# Altium project BMS_Masterboard (Trapezoid).PrjPcb (part 2 of 2)

## Sheet PROCESSOR.SchDoc
size A
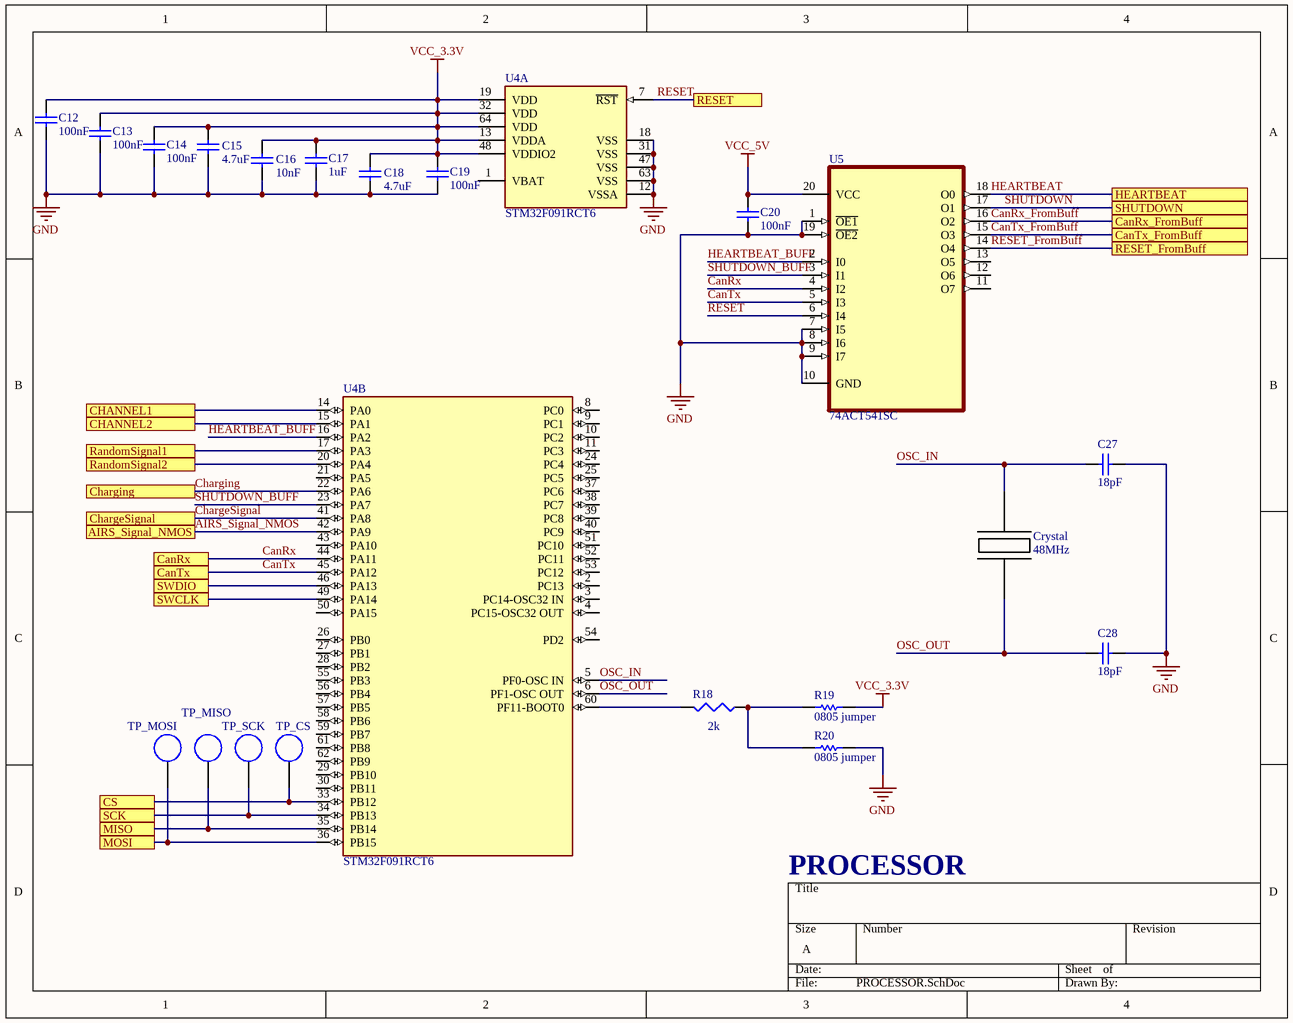
[diagram p2: PROCESSOR.SchDoc]

### Parts
C12  100nF  [Cap, 5mm TH, Ceramic]
C13  100nF  [Cap, 5mm TH, Ceramic]
C14  100nF  [Cap, 5mm TH, Ceramic]
C15  4.7uF  [Cap, 5mm TH, Ceramic]
C16  10nF  [Cap, 5mm TH, Ceramic]
C17  1uF  [Cap, 5mm TH, Ceramic]
C18  4.7uF  [Cap, 5mm TH, Ceramic]
C19  100nF  [Cap, 5mm TH, Ceramic]
C20  100nF  [Cap, 5mm TH, Ceramic]
C27  18pF  [Cap, 5mm TH, Ceramic]
C28  18pF  [Cap, 5mm TH, Ceramic]
Crystal  48MHz  [CrystalOscillator]
R18  2k  [1/4W TH Resistor]
R19  0805 jumper  [RESC2013X60X35LL20T20]
R20  0805 jumper  [RESC2013X60X35LL20T20]
TP_CS  5015  [5015]  (value not drawn)
TP_MISO  5015  [5015]  (value not drawn)
TP_MOSI  5015  [5015]  (value not drawn)
TP_SCK  5015  [5015]  (value not drawn)
U4  STM32F091RCT6  [FP-LQFP64-5W-MFG]  (parts A,B of 2)
U5  74ACT541SC  [SOIC127P1032X265-20N]

### Ports
AIRS_Signal_NMOS, CanRx, CanRx_FromBuff, CanTx, CanTx_FromBuff, CHANNEL1, CHANNEL2, ChargeSignal, Charging, CS, HEARTBEAT, MISO, MOSI, RandomSignal1, RandomSignal2, RESET, RESET_FromBuff, SCK, SHUTDOWN, SWCLK, SWDIO

### Nets
GND: C12.1(Pos) C13.1(Pos) C14.1(Pos) C15.1(Pos) C16.1(Pos) C17.1(Pos) C18.1(Pos) C19.1(Pos) C20.1(Pos) C27.1(Pos) C28.1(Pos) R20.1 U4.12(VSSA) U4.18(VSS) U4.31(VSS) U4.47(VSS) U4.63(VSS) U5.1(~{OE1}) U5.7(I5) U5.8(I6) U5.9(I7) U5.10(GND) U5.19(~{OE2})
VCC_3.3V: C12.2(Neg) C13.2(Neg) C14.2(Neg) C15.2(Neg) C16.2(Neg) C17.2(Neg) C18.2(Neg) C19.2(Neg) R19.2 U4.13(VDDA) U4.19(VDD) U4.32(VDD) U4.48(VDDIO2) U4.64(VDD)
VCC_5V: C20.2(Neg) U5.20(VCC)
AIRS_Signal_NMOS: U4.42(PA9) ; port AIRS_Signal_NMOS
CanRx: U4.44(PA11) U5.4(I2) ; port CanRx
CanRx_FromBuff: U5.16(O2) ; port CanRx_FromBuff
CanTx: U4.45(PA12) U5.5(I3) ; port CanTx
CanTx_FromBuff: U5.15(O3) ; port CanTx_FromBuff
CHANNEL1: U4.14(PA0) ; port CHANNEL1
CHANNEL2: U4.15(PA1) ; port CHANNEL2
ChargeSignal: U4.41(PA8) ; port ChargeSignal
Charging: U4.22(PA6) ; port Charging
HEARTBEAT: U5.18(O0) ; port HEARTBEAT
HEARTBEAT_BUFF: U4.16(PA2) U5.2(I0)
MISO: TP_MISO.1 U4.35(PB14) ; port MISO
OSC_IN: C27.2(Neg) Crystal.2 U4.5(PF0-OSC_IN)
OSC_OUT: C28.2(Neg) Crystal.1 U4.6(PF1-OSC_OUT)
RESET: U4.7(~{RST}) U5.6(I4) ; port RESET
RESET_FromBuff: U5.14(O4) ; port RESET_FromBuff
SHUTDOWN: U5.17(O1) ; port SHUTDOWN
SHUTDOWN_BUFF: U4.23(PA7) U5.3(I1)
SWCLK: U4.49(PA14) ; port SWCLK
SWDIO: U4.46(PA13) ; port SWDIO
NetR18_1: R18.1 R19.1 R20.2
NetR18_2: R18.2 U4.60(PF11-BOOT0)
NetTP_CS_1: TP_CS.1 U4.33(PB12) ; port CS
NetTP_MOSI_1: TP_MOSI.1 U4.36(PB15) ; port MOSI
NetTP_SCK_1: TP_SCK.1 U4.34(PB13) ; port SCK
NetU4_17: U4.17(PA3) ; port RandomSignal1
NetU4_20: U4.20(PA4) ; port RandomSignal2

Not connected (* = marked no-connect by the designer): U4 1(VBAT) 2(PC13) 3(PC14-OSC32_IN) 4(PC15-OSC32_OUT) 8(PC0) 9(PC1) 10(PC2) 11(PC3) 21(PA5) 24(PC4) 25(PC5) 26(PB0) 27(PB1) 28(PB2) 29(PB10) 30(PB11) 37(PC6) 38(PC7) 39(PC8) 40(PC9) 43(PA10) 50(PA15) 51(PC10) 52(PC11) 53(PC12) 54(PD2) 55(PB3) 56(PB4) 57(PB5) 58(PB6) 59(PB7) 61(PB8) 62(PB9); U5 11(O7) 12(O6) 13(O5)

### Notes on the sheet
- PROCESSOR

### Library data of the parts
C12-C20 C27 C28 = Cap, 5MM TH, Ceramic: Generic Cap, 5MM TH, Ceramic; TargetLibrary: RITRacing-Passives; Value: Value?; Publisher: T.Tallo; Published: 22Oct2016; Status: Active
Crystal = CrystalOscillator
R18 = Resistor, TH: Generic TH Resistor; TargetLibrary: RITRacing-Passives; Value: Value?; Publisher: T.Tallo; Published: 22Oct2016; Status: Active
R19 R20 = CMP-2000-06973-1: Chip Resistor, 0 Ohm, +/- 5%, 0.125 W, -55 to 155 degC, 0805 (2012 Metric) , RoHS, Tape and Reel; Manufacturer: Samsung Electro-Mechanics; Resistance: 0O; Temp Coefficient: ±200ppm/°C; Rated Power: 0.125W; Mounting Technology: SurfaceMount; Tolerance (%): ±5%; Package Reference: 0805; Size Code: 0805; Package Description: 2-Pin Chip Resistor, Body 2 x 1.25 mm; Manufacturer URL: http://www.samsungsem.com/global/index.jsp; Datasheet URL: https://datasheet.ciiva.com/15196/getdatasheetpartid-499011-15196236.pdf; Datasheet Version: 11/2010
TP_CS TP_MISO TP_MOSI TP_SCK = 5015: SMD Test Point; Manufacturer: Keystone Electronics; TargetLibrary: RITRacing-Connectors; PartNumber: 5015; Publisher: T.Tallo; Published: 22Oct2016; Status: Active; ComponentLink1URL: http://www.mouser.com/ds/2/215/005-5009-743680.pdf; ComponentLink1Description: Datasheet
U4 = CMP-12105-000069-1: IC MCU 32BIT 256KB FLASH 64LQFP; Manufacturer: STMicroelectronics; Ram Size: 32KBytes; Number Of A/D Converters: 1; Standoff Height: 0.05mm; Number Of I/Os: 52; Number Of Pwm Channels: 6; Max Supply Voltage: 3.6V; Data Bus Width: 32bits; Max Junction Temp: +105°C; Number Of Spi Channels: 2; Min Supply Voltage: 2V; Number Of Adc Channels: 19; Memory Size: 256KBytes; Frequency: 48MHz; Nominal Supply Current: 0.9-26.9mA; Number Of Uart Channels: 8; Core Architecture: ARM Cortex-M0; Number Of Timers/Counters: 10; Interface: I2C,SPI,USART,CAN,LIN,IrDA,I2S,SMBus; Category: IC; Digikey Description: IC MCU 32BIT 256KB FLASH 64LQFP; Temperature Range Low: -40°C; Lead Free: Yes; ComponentLink2Description: Datasheet; Octopart: https://octopart.com/stm32f091rct6-stmicroelectronics-51988683; Device Class L1: Integrated Circuits (ICs); Automotive: No; Temperature Range High: +85°C; Ambient Temperature Range Low: -40°C; Device Class L2: Embedded Processors and Controllers; Number Of I2C Channels: 2; Memory Type: FLASH; Device Class L3: Microcontrollers; Height: 1.6mm; Temperature: -40°C to +85°C; Ambient Temperature Range High: +85°C; RoHS: TRUE; Ipc Land Pattern Name: QFP50P1200X1200X160-64; ComponentLink2URL: https://www.st.com/resource/en/datasheet/stm32f091rc.pdf; Manufacturer Part Number: STM32F091RCT6; Package: LQFP64-5W; Mouser Description: ARM Microcontrollers - MCU 16/32-BITS MICROS; Number Of Cores: 1
U5 = 74ACT541SC: Buffer, Non-Inverting 1 Element 8 Bit per Element 3-State Output 20-SOIC; MF: ON Semiconductor; DigiKey-Purchase-URL: https://snapeda.com/shop?store=DigiKey&id=431052; Mouser-Purchase-URL: https://snapeda.com/shop?store=Mouser&id=431052; SnapEDA_Link: https://www.snapeda.com/parts/74ACT541SC/ON%20Semiconductor/view-part/431052/?ref=snap; Price: None; Arrow_Electronics-Purchase-URL: https://snapeda.com/shop?store=Arrow+Electronics&id=431052; MP: 74ACT541SC; Value: *; Availability: Warning; Package: SOIC-20 Fairchild Semiconductor

## Sheet COMMUNICATIONS.SchDoc
size A
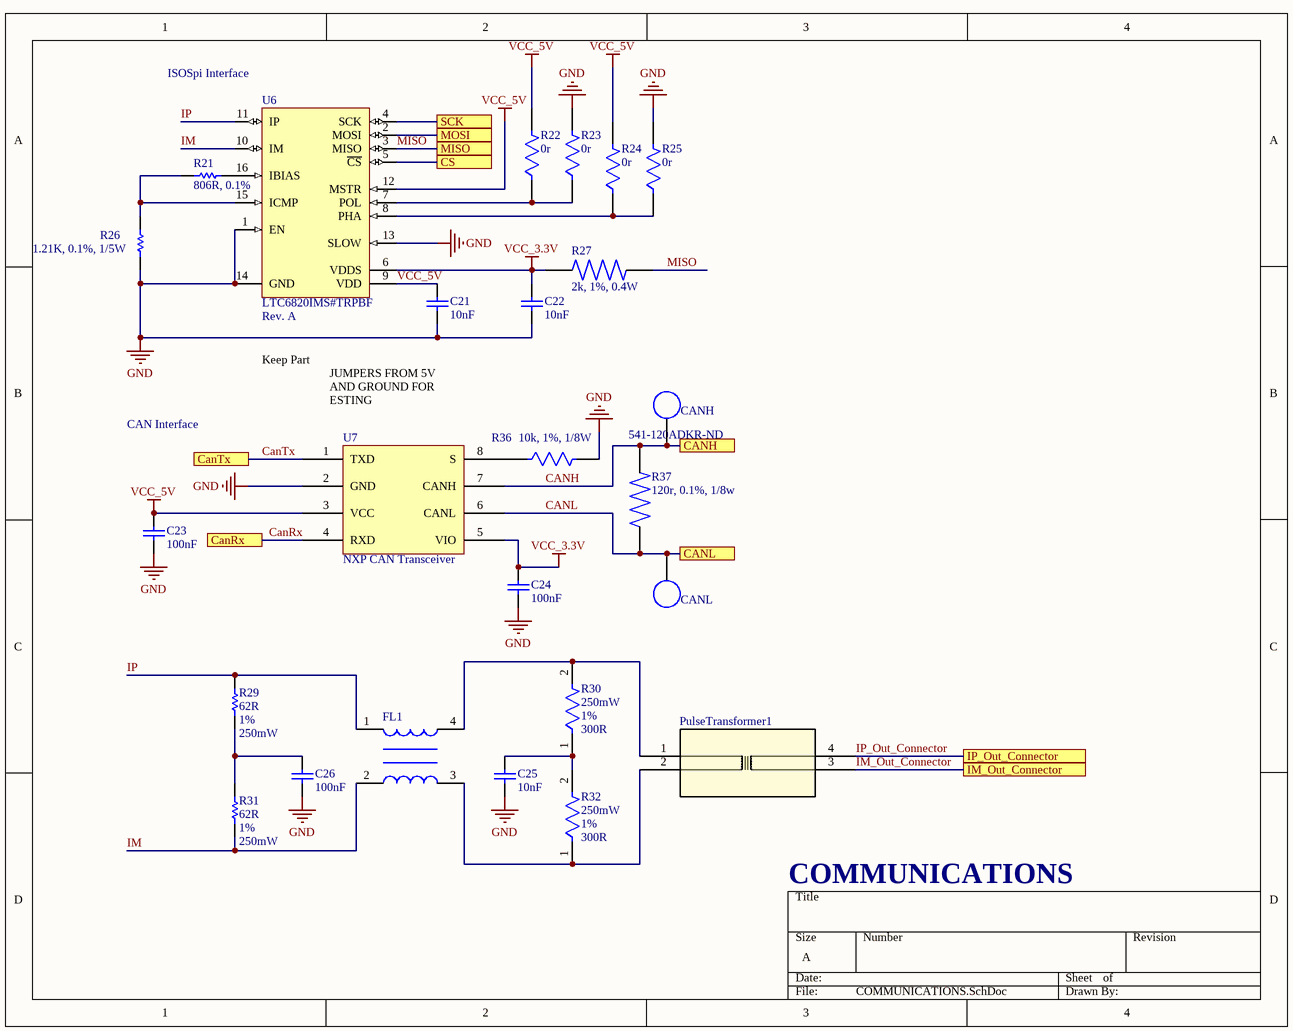
[diagram p3: COMMUNICATIONS.SchDoc]

### Parts
C21  10nF  [CAPC2013X70X45LL15T25]
C22  10nF  [CAPC2013X70X45LL15T25]
C23  100nF  [CAPC2013X145X45NL30T25]
C24  100nF  [CAPC2013X145X45NL30T25]
C25  10nF  [CAPC2013X70X45LL15T25]
C26  100nF  [CAPC2013X145X45NL30T25]
CANH  5015  [5015]  (value not drawn)
CANL  5015  [5015]  (value not drawn)
FL1  ACT45B-220-2P-TL003  [FIL_ACT45B-220-2P-TL003]  (value not drawn)
PulseTransformer1  PE-68386NLT  [PE-68386NL_PUL]  (value not drawn)
R21  806R, 0.1%  [RESC2013X50X30NL20T20]
R22  0r  [FP-CRCW0805-HPe3-IPC_A]
R23  0r  [FP-CRCW0805-HPe3-IPC_A]
R24  0r  [FP-CRCW0805-HPe3-IPC_A]
R25  0r  [FP-CRCW0805-HPe3-IPC_A]
R26  1.21K, 0.1%, 1/5W  [RESC2013X50X30NL20T20]
R27  2k, 1%, 0.4W  [RESC2012X50N]
R29  Resistance: 62R  Tolerance: 1%  Max Power Dissipation: 250mW  [RESC3216X70X50NL05T20]  (hidden comment: ERJ-8ENF62R0V)
R30  Power Rating: 250mW  Tolerance: 1%  Resistance: 300R  [FP-CRCW1206-e3-IPC_A]  (hidden comment: CRCW1206300RFKEA)
R31  Resistance: 62R  Tolerance: 1%  Max Power Dissipation: 250mW  [RESC3216X70X50NL05T20]  (hidden comment: ERJ-8ENF62R0V)
R32  Power Rating: 250mW  Tolerance: 1%  Resistance: 300R  [FP-CRCW1206-e3-IPC_A]  (hidden comment: CRCW1206300RFKEA)
R36  10k, 1%, 1/8W  [FP-CRCW0805-e3-IPC_A]
R37  120r, 0.1%, 1/8w  Supplier Part Number 1: 541-120ADKR-ND  [RESC2012X55N]
U6  LTC6820IMS#TRPBF  DatasheetVersion: Rev. A  [TSSOP50P490X110-16N]
U7  NXP CAN Transceiver  [NXP CAN Tranceiver]

### Ports
CANH, CANL, CanRx, CanTx, CS, IM_Out_Connector, IP_Out_Connector, MISO, MOSI, SCK

### Nets
GND: C21.1 C22.1 C23.1 C24.1 C25.1 C26.1 R23.2 R25.2 R26.1 R36.2 U6.1(EN) U6.13(SLOW) U6.14(GND) U7.2(GND)
VCC_3.3V: C22.2 C24.2 R27.2 U6.6(VDDS) U7.5(VIO)
VCC_5V: C21.2 C23.2 R22.2 R24.2 U6.9(VDD) U6.12(MSTR) U7.3(VCC)
CANH: CANH.1 R37.2 U7.7(CANH) ; port CANH
CANL: CANL.1 R37.1 U7.6(CANL) ; port CANL
CanRx: U7.4(RXD) ; port CanRx
CanTx: U7.1(TXD) ; port CanTx
IM: FL1.2 R31.1 U6.10(IM)
IM_Out_Connector: PulseTransformer1.3 ; port IM_Out_Connector
IP: FL1.1 R29.2 U6.11(IP)
IP_Out_Connector: PulseTransformer1.4 ; port IP_Out_Connector
MISO: R27.1 U6.3(MISO) ; port MISO
NetC25_2: C25.2 R30.1 R32.2
NetC26_2: C26.2 R29.1 R31.2
NetFL1_3: FL1.3 PulseTransformer1.2 R32.1
NetFL1_4: FL1.4 PulseTransformer1.1 R30.2
NetR21_1: R21.1 R26.2 U6.15(ICMP)
NetR21_2: R21.2 U6.16(IBIAS)
NetR22_1: R22.1 R23.1 U6.7(POL)
NetR24_1: R24.1 R25.1 U6.8(PHA)
NetR36_1: R36.1 U7.8(S)
NetTP_CS_1: U6.5(~{CS}) ; port CS
NetTP_MOSI_1: U6.2(MOSI) ; port MOSI
NetTP_SCK_1: U6.4(SCK) ; port SCK

### Notes on the sheet
- (near U6) ISOSpi Interface
- Keep Part
- CAN Interface
- JUMPERS FROM 5V AND GROUND FOR ESTING
- COMMUNICATIONS

### Library data of the parts
C21 C22 C25 = CMP-2007-00806-1: Manufacturer: Murata; Part Number: GCM216R72A103KA37D; Tolerance: 10%; Voltage Rating: 100V; Dielectric: X7R; Supplier 1: Digi-Key; Supplier Part Number 1: 490-6060-1-ND; Manufacturer 1: Murata; Manufacturer Part Number 1: GCM216R72A103KA37D; RoHS: Yes; Category: Ceramic Capacitors; Stock 1: 2316; Pricing 1: 1=0.36000, 10=0.24900, 50=0.16640, 100=0.14140, 500=0.09980, 1000=0.08732 (USD); Mount: Surface Mount; Case/Package: 0805; Case Code (Metric): 2012; Case Code (Imperial): 0805; Min Operating Temperature: -55°C; Max Operating Temperature: 125°C; Capacitance: 10nF; Packaging: Tape and Reel; Package Quantity: 1; Termination: SMD/SMT; Voltage Rating (DC): 100V; Voltage: 100V; Series: GCM; Construction: Flat; Length: 2mm; Width: 0.049inch; Height: 0.6mm; Thickness: 0.028inch; Depth: 1.25mm; Ratings: AEC-Q200; Radiation Hardening: No; Lead Free: Lead Free; RoHS Compliant: Yes; ComponentLink1URL: https://datasheet.ciiva.com/11620/product-11620072.pdf?src-supplier=Avnet; ComponentLink1Description: https://datasheet.ciiva.com/11620/product-11620072.pdf?src-supplier=Avnet; ComponentLink2URL: https://datasheet.ciiva.com/18183/getdatasheetpartid-223896-18183680.pdf?src-supplier=Verical; ComponentLink2Description: https://datasheet.ciiva.com/18183/getdatasheetpartid-223896-18183680.pdf?src-supplier=Verical; ComponentLink3URL: https://datasheet.ciiva.com/6270/s0717e-6270558.pdf?src-supplier=Digi-Key; ComponentLink3Description: https://datasheet.ciiva.com/6270/s0717e-6270558.pdf?src-supplier=Digi-Key; ComponentLink4URL: https://datasheet.ciiva.com/16214/s0717e-16214647.pdf?src-supplier=Future+Electronics; ComponentLink4Description: https://datasheet.ciiva.com/16214/s0717e-16214647.pdf?src-supplier=Future+Electronics
C23 C24 C26 = CMP-2007-03212-1: Manufacturer: Murata; Part Number: GCJ21BR71H104KA01L; Tolerance: 10%; Voltage Rating: 50V; Dielectric: X7R; Supplier 1: Digi-Key; Supplier Part Number 1: 490-5803-1-ND; Manufacturer 1: Murata; Manufacturer Part Number 1: GCJ21BR71H104KA01L; RoHS: Yes; Category: Ceramic Capacitors; Stock 1: 105376; Pricing 1: 1=0.48000, 10=0.34200, 50=0.25880, 100=0.22540, 500=0.16698, 1000=0.14193 (USD); Mount: Surface Mount; Case/Package: 0805; Case Code (Imperial): 0805; Case Code (Metric): 2012; Min Operating Temperature: -55°C; Max Operating Temperature: 125°C; Capacitance: 100nF; Packaging: Tape and Reel; Package Quantity: 3000; Termination: SMD/SMT; Voltage Rating (DC): 50V; Series: GCJ; Construction: Flat; Features: Soft Termination; Length: 2mm; Width: 0.049inch; Height: 1.25mm; Thickness: 0.057inch; Depth: 1.25mm; Ratings: AEC-Q200; Radiation Hardening: No; RoHS Compliant: Yes; Lead Free: Lead Free; ComponentLink1URL: https://datasheet.ciiva.com/17453/product-17453782.pdf?src-supplier=Avnet+Europe; ComponentLink1Description: https://datasheet.ciiva.com/17453/product-17453782.pdf?src-supplier=Avnet+Europe; ComponentLink2URL: https://datasheet.ciiva.com/18183/getdatasheetpartid-663717-18183469.pdf?src-supplier=Verical; ComponentLink2Description: https://datasheet.ciiva.com/18183/getdatasheetpartid-663717-18183469.pdf?src-supplier=Verical; ComponentLink3URL: https://datasheet.ciiva.com/136/s0717e-136749.pdf?src-supplier=Digi-Key; ComponentLink3Description: https://datasheet.ciiva.com/136/s0717e-136749.pdf?src-supplier=Digi-Key; ComponentLink4URL: https://datasheet.ciiva.com/136/s0717e-136750.pdf?src-supplier=Digi-Key; ComponentLink4Description: https://datasheet.ciiva.com/136/s0717e-136750.pdf?src-supplier=Digi-Key; ComponentLink5URL: https://datasheet.ciiva.com/136/s0717e-136751.pdf?src-supplier=Digi-Key; ComponentLink5Description: https://datasheet.ciiva.com/136/s0717e-136751.pdf?src-supplier=Digi-Key
CANH CANL = 5015: as TP_CS on sheet PROCESSOR; PartNumber: 5015; Publisher: T.Tallo; Published: 22Oct2016; Status: Active; ComponentLink1URL: http://www.mouser.com/ds/2/215/005-5009-743680.pdf; ComponentLink1Description: Datasheet
FL1 = ACT45B-220-2P-TL003: 100ÂµH @ 100kHz 2 Line Common Mode Choke Surface Mount 5.8 kOhms @ 10MHz 150mA DCR 2Ohm; Package: None; Price: None; Value: *; MP: ACT45B-220-2P-TL003; Availability: Unavailable; Supplier 1: Digi-Key; Supplier Part Number 1: 445-3957-1-ND; Supplier 2: Digi-Key; Supplier Part Number 2: 445-3957-6-ND; Supplier 3: Digi-Key; Supplier Part Number 3: 445-3957-2-ND; Supplier 4: Mouser; Supplier Part Number 4: 810-ACT45B2202PTL003
PulseTransformer1 = PE-68386NLT: No Description Available; Vendor: Pulse Electronics Corporation; Built_By: EMA_Cory; SourceLibrary: Pulse_Electronics_2019-12-18; Manufacturer_Part_Number: PE-68386NLT; Copyright: Copyright (C) 2018 Accelerated Designs. All rights reserved; RefDes: RefDes; Type: DEV; Supplier 1: Digi-Key; Supplier Part Number 1: 553-1776-1-ND; Supplier 2: Digi-Key; Supplier Part Number 2: 553-1776-6-ND; Supplier 3: Digi-Key; Supplier Part Number 3: 553-1776-2-ND; Supplier 4: Mouser; Supplier Part Number 4: 673-PE-68386NLT
R21 = CMP-2001-04126-1: Part Number: CRCW0805806RFKEA; Manufacturer: Vishay Dale; Manufacturer Part Number 1: TNPW0805806RBEEN; Power Rating: 125mW; Voltage Rating: 150V; Temperature Coefficient: 25ppm/°C; Voltage Rating (DC): 100V; Supplier 1: Digi-Key; Supplier Part Number 1: 541-TNPW0805806RBEENTR-ND; Manufacturer 1: Vishay Dale; RoHS: Yes; Category: Chip SMD Resistors; Pricing 1: 1000=0.31280 (USD); Case/Package: 0805; Case Code (Metric): 2012; Case Code (Imperial): 0805; Contact Plating: Tin; Min Operating Temperature: -55°C; Max Operating Temperature: 125°C; Package Quantity: 1000; Packaging: Tape and Reel; Resistance: 806R; Tolerance: 0.1%; Resistor Type: Thin Film; Number of Terminations: 2; Termination: SMD/SMT; Max Power Dissipation: 125mW; Features: Moisture Resistant,Automotive AEC-Q200,Anti-Sulfur; Series: TNPW; Length: 0.079inch; Width: 0.049inch; Height: 0.022inch; Radiation Hardening: No; RoHS Compliant: Yes; ComponentLink1URL: https://datasheet.ciiva.com/2612/tnpw-e3-2612881.pdf?src-supplier=Digi-Key; ComponentLink1Description: https://datasheet.ciiva.com/2612/tnpw-e3-2612881.pdf?src-supplier=Digi-Key; ComponentLink2URL: https://datasheet.ciiva.com/8919/tnpw-e3-8919757.pdf?src-supplier=Avnet; ComponentLink2Description: https://datasheet.ciiva.com/8919/tnpw-e3-8919757.pdf?src-supplier=Avnet; ComponentLink3URL: https://datasheet.ciiva.com/48524/tnpw-e3-48524410.pdf?src-supplier=Avnet; ComponentLink3Description: https://datasheet.ciiva.com/48524/tnpw-e3-48524410.pdf?src-supplier=Avnet; Supplier 2: Mouser; Supplier Part Number 2: 71-TNPW0805806RBEEN; Manufacturer 2: Vishay Dale; Manufacturer Part Number 2: TNPW0805806RBEEN; Stock 2: 696; Pricing 2: 1=0.92000, 10=0.82300, 50=0.82300, 100=0.62200, 500=0.52900, 1000=0.29900, 10000=0.26400 (USD)
R22-R25 = CMP-2001-04185-2: RES Thick Film, 0Ω, 0.5W, 0805; Manufacturer 1: Vishay Dale; Manufacturer Part Number 1: CRCW08050000Z0EAHP; Resistance: 0mR; Max Power Dissipation: 500mW; Power Rating: 330mW; Voltage Rating (DC): 150V; Temperature Coefficient: 0ppm/°C; Tolerance: 5%; Min Operating Temperature: -55°C; Features: Automotive AEC-Q200; Weight: 0.000194oz; Case Code (Metric): 2012; Package Quantity: 5000; Packaging: Tape and Reel; Height: 0.024inch; Composition: Thick Film; Case Code (Imperial): 0805; Military Standard: Not; Number of Pins: 2; Termination: Solder; Lead Free: Lead Free; Max Operating Temperature: 155°C; Radiation Hardening: No; Voltage Rating: 150V; Width: 0.049inch; Number of Terminations: 2; Contact Plating: Tin; Length: 2mm; Depth: 1.25mm; Case/Package: 0805; REACH SVHC: No SVHC; Mount: Surface Mount; Supplier 1: Digi-Key; Supplier Part Number 1: 541-0.0TBCT-ND; RoHS: Yes; Category: Chip SMD Resistors; Stock 1: 60898; Pricing 1: 1=0.21000, 10=0.17600, 25=0.12800, 50=0.09280, 100=0.06880, 250=0.05280, 500=0.04160, 1000=0.02880 (USD); Size Code: 0805; Resistor Type: Thick Film; Series: CRCW-HP; Construction: Rectangular; Technology: THICK FILM; RoHS Compliant: Yes; ComponentLink1URL: https://datasheet.ciiva.com/2474/crcwhpe3-2474632.pdf?src-supplier=Digi-Key; ComponentLink1Description: https://datasheet.ciiva.com/2474/crcwhpe3-2474632.pdf?src-supplier=Digi-Key; ComponentLink2URL: https://datasheet.ciiva.com/2474/crcwhpe3-2474633.pdf?src-supplier=Digi-Key; ComponentLink2Description: https://datasheet.ciiva.com/2474/crcwhpe3-2474633.pdf?src-supplier=Digi-Key; ComponentLink3URL: https://datasheet.ciiva.com/2474/crcwhpe3-2474634.pdf?src-supplier=Digi-Key; ComponentLink3Description: https://datasheet.ciiva.com/2474/crcwhpe3-2474634.pdf?src-supplier=Digi-Key; ComponentLink4URL: https://datasheet.ciiva.com/9109/crcwhpe3-9109934.pdf?src-supplier=Avnet; ComponentLink4Description: https://datasheet.ciiva.com/9109/crcwhpe3-9109934.pdf?src-supplier=Avnet; ComponentLink5URL: https://datasheet.ciiva.com/5549/crcwhpe3-46056-5549241.pdf?src-supplier=Mouser; ComponentLink5Description: https://datasheet.ciiva.com/5549/crcwhpe3-46056-5549241.pdf?src-supplier=Mouser; ComponentLink6URL: https://datasheet.ciiva.com/16883/crcwhpe3-16883643.pdf?src-supplier=Avnet+Europe; ComponentLink6Description: https://datasheet.ciiva.com/16883/crcwhpe3-16883643.pdf?src-supplier=Avnet+Europe; ComponentLink7URL: https://datasheet.ciiva.com/16498/crcwhpe3-16498294.pdf?src-supplier=Future+Electronics; ComponentLink7Description: https://datasheet.ciiva.com/16498/crcwhpe3-16498294.pdf?src-supplier=Future+Electronics; ComponentLink8URL: https://datasheet.ciiva.com/28621/1750852-28621406.pdf?src-supplier=Element14; ComponentLink8Description: https://datasheet.ciiva.com/28621/1750852-28621406.pdf?src-supplier=Element14; ComponentLink9URL: https://datasheet.ciiva.com/7859/crcwhpe3-7859727.pdf?src-supplier=Element14; ComponentLink9Description: https://datasheet.ciiva.com/7859/crcwhpe3-7859727.pdf?src-supplier=Element14
R26 = CMP-2001-04126-1: Part Number: CRCW0805806RFKEA; Manufacturer: Vishay Dale; Manufacturer Part Number 1: TNPW0805806RBEEN; Resistance: 806R; Power Rating: 125mW; Voltage Rating: 150V; Temperature Coefficient: 25ppm/°C; Voltage Rating (DC): 100V; Supplier 1: Digi-Key; Supplier Part Number 1: 541-TNPW0805806RBEENTR-ND; Manufacturer 1: Vishay Dale; RoHS: Yes; Category: Chip SMD Resistors; Pricing 1: 1000=0.31280 (USD); Case/Package: 0805; Case Code (Metric): 2012; Case Code (Imperial): 0805; Contact Plating: Tin; Min Operating Temperature: -55°C; Max Operating Temperature: 125°C; Package Quantity: 1000; Packaging: Tape and Reel; Tolerance: 0.1%; Resistor Type: Thin Film; Number of Terminations: 2; Termination: SMD/SMT; Max Power Dissipation: 125mW; Features: Moisture Resistant,Automotive AEC-Q200,Anti-Sulfur; Series: TNPW; Length: 0.079inch; Width: 0.049inch; Height: 0.022inch; Radiation Hardening: No; RoHS Compliant: Yes; ComponentLink1URL: https://datasheet.ciiva.com/2612/tnpw-e3-2612881.pdf?src-supplier=Digi-Key; ComponentLink1Description: https://datasheet.ciiva.com/2612/tnpw-e3-2612881.pdf?src-supplier=Digi-Key; ComponentLink2URL: https://datasheet.ciiva.com/8919/tnpw-e3-8919757.pdf?src-supplier=Avnet; ComponentLink2Description: https://datasheet.ciiva.com/8919/tnpw-e3-8919757.pdf?src-supplier=Avnet; ComponentLink3URL: https://datasheet.ciiva.com/48524/tnpw-e3-48524410.pdf?src-supplier=Avnet; ComponentLink3Description: https://datasheet.ciiva.com/48524/tnpw-e3-48524410.pdf?src-supplier=Avnet; Supplier 2: Mouser; Supplier Part Number 2: 71-TNPW0805806RBEEN; Manufacturer 2: Vishay Dale; Manufacturer Part Number 2: TNPW0805806RBEEN; Stock 2: 696; Pricing 2: 1=0.92000, 10=0.82300, 50=0.82300, 100=0.62200, 500=0.52900, 1000=0.29900, 10000=0.26400 (USD); Supplier 3: Digi-Key; Supplier Part Number 3: 541-2057-1-ND; Manufacturer 3: Vishay Dale; Manufacturer Part Number 3: TNPW08051K21BEEA; Stock 3: 4750; Pricing 3: 1=0.74000, 10=0.54800, 100=0.31930, 1000=0.17905, 2500=0.17544 (USD); Resistance Tolerance: 0.1%; REACH SVHC: Unknown; ComponentLink4URL: https://datasheet.ciiva.com/9105/tnpw-e3-9105739.pdf?src-supplier=Avnet; ComponentLink4Description: https://datasheet.ciiva.com/9105/tnpw-e3-9105739.pdf?src-supplier=Avnet; ComponentLink5URL: https://datasheet.ciiva.com/2608/tnpw-e3-2608321.pdf?src-supplier=Digi-Key; ComponentLink5Description: https://datasheet.ciiva.com/2608/tnpw-e3-2608321.pdf?src-supplier=Digi-Key; ComponentLink6URL: https://datasheet.ciiva.com/41828/tnpw-e3-41828137.pdf?src-supplier=Digi-Key; ComponentLink6Description: https://datasheet.ciiva.com/41828/tnpw-e3-41828137.pdf?src-supplier=Digi-Key
R27 = RCS08052K00FKEA: Res Thick Film 0805 2K Ohm 1% 0.4W ±100ppm/C Pad SMD Automotive T/R; Manufacturer 1: Vishay Dale; Resistance: 2kR; Max Power Dissipation: 400mW; Temperature Coefficient: 100ppm/°C; Package: None; Price: None; Value: *; MP: RCS08052K00FKEA; Availability: Unavailable; Supplier 1: Digi-Key; Supplier Part Number 1: 541-2840-1-ND; Manufacturer Part Number 1: RCS08052K00FKEA; RoHS: Yes; Category: Chip SMD Resistors; Stock 1: 4243; Pricing 1: 1=0.26000, 10=0.21800, 100=0.08510, 1000=0.03560, 2500=0.03264 (USD); Case/Package: 0805; Case Code (Metric): 2012; Case Code (Imperial): 0805; Min Operating Temperature: -55°C; Max Operating Temperature: 155°C; Packaging: Tape and Reel; Resistor Type: Thick Film; Number of Terminations: 2; Tolerance: 1%; Features: Automotive AEC-Q200; Length: 0.079inch; Width: 0.049inch; Height: 0.02inch; ComponentLink1URL: http://www.vishay.com/docs/20065/rcse3.pdf?src-supplier=Digi-Key; ComponentLink1Description: http://www.vishay.com/docs/20065/rcse3.pdf?src-supplier=Digi-Key
R29 R31 = CMP-2003-00451-1: Manufacturer: Panasonic; Temperature Coefficient: 100ppm/°C; Voltage Rating: 200V; Part Number: ERJ-8ENF62R0V; Supplier 1: Digi-Key; Supplier Part Number 1: P62.0FCT-ND; Manufacturer 1: Panasonic; Manufacturer Part Number 1: ERJ-8ENF62R0V; RoHS: Yes; Category: Chip SMD Resistors; Stock 1: 91284; Pricing 1: 1=0.10000, 10=0.09300, 100=0.03560, 1000=0.01569, 2500=0.01355 (USD); Mount: Surface Mount; Case/Package: 1206; Contact Plating: Tin; Case Code (Imperial): 1206; Case Code (Metric): 3216; Min Operating Temperature: -55°C; Max Operating Temperature: 155°C; Resistor Type: Thick Film; Packaging: Tape and Reel; Power Rating: 250mW; Package Quantity: 1; Termination: SMD/SMT; Number of Terminations: 2; Voltage Rating (DC): 200V; Features: Automotive AEC-Q200; Series: ERJ; Resistance Tolerance: 1%; Construction: Rectangular; Length: 3.2mm; Width: 1.6mm; Height: 0.028inch; Depth: 1.6mm; Radiation Hardening: No; REACH SVHC: Yes; Military Standard: Not; Lead Free: Lead Free; RoHS Compliant: Yes; ComponentLink1URL: https://datasheet.ciiva.com/9188/aoa0000ce2-9188406.pdf?src-supplier=Avnet; ComponentLink1Description: https://datasheet.ciiva.com/9188/aoa0000ce2-9188406.pdf?src-supplier=Avnet; ComponentLink2URL: https://datasheet.ciiva.com/22762/1678782-22762886.pdf?src-supplier=Farnell; ComponentLink2Description: https://datasheet.ciiva.com/22762/1678782-22762886.pdf?src-supplier=Farnell; ComponentLink3URL: https://datasheet.ciiva.com/46440/1678782-46440394.pdf?src-supplier=Element14; ComponentLink3Description: https://datasheet.ciiva.com/46440/1678782-46440394.pdf?src-supplier=Element14; Supplier 2: Digi-Key; Supplier Part Number 2: P62.0FDKR-ND; Manufacturer 2: Panasonic; Manufacturer Part Number 2: ERJ-8ENF62R0V; Stock 2: 91284; Pricing 2: 1=0.10000, 10=0.09300, 100=0.03560, 1000=0.01569, 2500=0.01355 (USD); Supplier 3: Newark; Supplier Part Number 3: 90W3970; Manufacturer 3: Panasonic; Manufacturer Part Number 3: ERJ-8ENF62R0V; Stock 3: 46632; Pricing 3: 1=0.00800, 25=0.00800, 50=0.00800, 100=0.00800, 250=0.00800, 500=0.00800, 1000=0.00800 (USD); Supplier 4: Mouser; Supplier Part Number 4: 667-ERJ-8ENF62R0V; Manufacturer 4: Panasonic; Manufacturer Part Number 4: ERJ-8ENF62R0V; Stock 4: 31443; Pricing 4: 1=0.10000, 10=0.09300, 50=0.09300, 100=0.03800, 250=0.03700, 500=0.03600, 1000=0.01600, 2500=0.01400, 5000=0.01300, 10000=0.01300 (USD)
R30 R32 = CMP-1014-00449-3: RES Thick Film, 300Ω, 1%, 0.25W, 100ppm/°C, 1206; Voltage Rating (DC): 200V; Number of Terminations: 2; Weight: 0.000353oz; Max Operating Temperature: 155°C; Features: Automotive AEC-Q200; Min Operating Temperature: -55°C; Case Code (Imperial): 1206; Voltage Rating: 200V; Termination: SMD/SMT; Military Standard: Not; Composition: Thick Film; Mount: Surface Mount; Package Quantity: 10; Length: 3.2mm; Depth: 1.6mm; Temperature Coefficient: 100ppm/°C; Width: 0.063inch; Contact Plating: Tin; Lead Free: Lead Free; Case Code (Metric): 3216; Radiation Hardening: No; Max Power Dissipation: 250mW; Working Voltage: 200V; Packaging: Tape and Reel; Height: 0.55mm; Case/Package: 1206; Supplier 1: Newark; Supplier Part Number 1: 27W4914
R36 = CMP-2001-04908-2: RES Thick Film, 10kΩ, 1%, 0.125W, 100ppm/°C, 0805; Manufacturer 1: Vishay; Manufacturer Part Number 1: CRCW080510K0FKEA; Resistance: 10kR; Voltage Rating (DC): 150V; Power Rating: 125mW; Weight: 0.000194oz; Package Quantity: 5000; Military Standard: Not; Max Operating Temperature: 155°C; Temperature Coefficient: 100ppm/°C; Contact Plating: Tin; Width: 1.25mm; Height: 0.45mm; Radiation Hardening: No; Tolerance: 1%; Min Operating Temperature: -55°C; Voltage Rating: 150V; Length: 2mm; Depth: 1.25mm; Termination: SMD/SMT; Packaging: Tape and Reel; Case/Package: 0805; Case Code (Metric): 2012; Lead Free: Lead Free; Case Code (Imperial): 0805; Composition: Thick Film; Supplier 1: Newark; Supplier Part Number 1: 25AC7644; RoHS: Yes; Category: Chip SMD Resistors; Stock 1: 1440000; Pricing 1: 1=0.01100, 5000=0.01100 (USD); Size Code: 0805; Resistor Type: Thick Film; Features: Automotive AEC-Q200; Series: CRCW; Max Power Dissipation: 125mW; Number of Terminations: 2; Construction: Rectangular; Resistance Tolerance: 1%; Technology: THICK FILM; RoHS Compliant: Yes; REACH SVHC: Unknown; ComponentLink1URL: https://datasheet.ciiva.com/11808/0900766b80d98b26-11808216.pdf?src-supplier=RSComponents; ComponentLink1Description: https://datasheet.ciiva.com/11808/0900766b80d98b26-11808216.pdf?src-supplier=RSComponents; ComponentLink2URL: https://datasheet.ciiva.com/8337/dcrcwe3-8337773.pdf?src-supplier=Avnet; ComponentLink2Description: https://datasheet.ciiva.com/8337/dcrcwe3-8337773.pdf?src-supplier=Avnet; ComponentLink3URL: https://datasheet.ciiva.com/8337/dcrcwe3-8337774.pdf?src-supplier=Avnet; ComponentLink3Description: https://datasheet.ciiva.com/8337/dcrcwe3-8337774.pdf?src-supplier=Avnet; ComponentLink4URL: https://datasheet.ciiva.com/5547/dcrcwe3-109170-5547559.pdf?src-supplier=Mouser; ComponentLink4Description: https://datasheet.ciiva.com/5547/dcrcwe3-109170-5547559.pdf?src-supplier=Mouser; ComponentLink5URL: https://datasheet.ciiva.com/46394/1720486-46394381.pdf?src-supplier=Element14; ComponentLink5Description: https://datasheet.ciiva.com/46394/1720486-46394381.pdf?src-supplier=Element14; ComponentLink6URL: https://datasheet.ciiva.com/16199/dcrcwe3-16199086.pdf?src-supplier=Future+Electronics; ComponentLink6Description: https://datasheet.ciiva.com/16199/dcrcwe3-16199086.pdf?src-supplier=Future+Electronics; ComponentLink7URL: https://datasheet.ciiva.com/16883/dcrcwe3-16883708.pdf?src-supplier=Avnet+Europe; ComponentLink7Description: https://datasheet.ciiva.com/16883/dcrcwe3-16883708.pdf?src-supplier=Avnet+Europe; ComponentLink8URL: https://datasheet.ciiva.com/16719/70201119-16719082.pdf?src-supplier=Allied+Electronics; ComponentLink8Description: https://datasheet.ciiva.com/16719/70201119-16719082.pdf?src-supplier=Allied+Electronics; ComponentLink9URL: https://datasheet.ciiva.com/16514/dcrcwe3-16514907.pdf?src-supplier=Avnet+Asia; ComponentLink9Description: https://datasheet.ciiva.com/16514/dcrcwe3-16514907.pdf?src-supplier=Avnet+Asia; ComponentLink10URL: https://datasheet.ciiva.com/16755/70201119-16755389.pdf?src-supplier=Allied+Electronics; ComponentLink10Description: https://datasheet.ciiva.com/16755/70201119-16755389.pdf?src-supplier=Allied+Electronics; Supplier 2: Digi-Key; Supplier Part Number 2: 541-10.0KCCT-ND; Manufacturer 2: Vishay; Manufacturer Part Number 2: CRCW080510K0FKEA; Pricing 2: 1=0.10000, 10=0.06700, 100=0.02710, 1000=0.01219, 2500=0.01058 (USD)
R37 = TNPW08051K21BEEA: Package: None; Price: None; Value: *; MP: TNPW08051K21BEEA; Availability: Unavailable; Supplier 1: Digi-Key
U6 = CMP-0937-00011-1: IsoSPI Isolated Communication Interface, 2.7 to 5.5 V, -40 to 85 degC, 16-Pin MSOP (MS), Pb-Free, Tape and Reel; Manufacturer: Linear Technology; Manufacturer: Analog Devices / Linear Technology; IO Supply Current: 1 uA Max.; Supply Current, IDLE State: 2 uA; IO Supply Voltage Range: 1.7 to 5.5 V; Receiver Input Resistance: 35 kOhm; VBIAS: 1.9 to 2.1 V; Packing: Tape and Reel; PartNumber: LTC6820IMS#TRPBF; Mounting Technology: Surface Mount; ComponentLink2Description: Datasheet; ComponentLink3Description: Package Specification; ComponentLink1Description: Manufacturer URL; PackageVersion: Rev. A; Temperature Range (degC): -40 to 85; ComponentLink2URL: http://cds.linear.com/docs/en/datasheet/6820fa.pdf; Power Supply: 2.7 to 5.5 V; ComponentLink1URL: http://www.linear.com/; PackageDescription: 16-Pin Micro Small Outline Package, Body 4.039 x 3 mm, Pitch 0.5 mm; ComponentLink3URL: http://cds.linear.com/docs/en/packaging/05081669_A_MS16.pdf; PackageReference: MS-16; Manufacturer Part Number: LTC6820IMS#TRPBF; Supplier 1: Digi-Key; Supplier Part Number 1: LTC6820IMS#TRPBFCT-ND; Supplier 2: Mouser; Supplier Part Number 2: 584-LTC6820IMS#TRPBF
U7 = NXP CAN Transceiver: IC CAN TRANSEIVER HS 8SOIC; Manufacturer 1: NXP Semiconductors; Manufacturer Part Number 1: TJF1051T/1J; Data Rate: 5Mbps; Min Supply Voltage: 4.5V; Max Supply Voltage: 5.5V; Number of Transceivers: 1; Simplex/Duplex: Half Duplex; Receiver Hysteresis: 120mV; ComponentLink1Description: Datasheet; ComponentLink1URL: https://www.farnell.com/datasheets/2080616.pdf; ComponentLink2Description: Supplier Link; ComponentLink2URL: https://www.newark.com/nxp/tjf1051t-1j/can-transceiver-5mbps-soic-8/dp/61AC2368?gclid=CjwKCAiA1eKBBhBZEiwAX3gqlxQsUZSrTqhgUbpvxTd09IiKsEelRDLU8t4m6T0nWWFbevXOORPvhRoC6uIQAvD_BwE&mckv=sitHQX2q7_dc|pcrid|492622077320|plid||kword||match||slid||product|61AC2368|pgrid|108905520170|ptaid|pla-902764019279|&CMP=KNC-GUSA-GEN-Shopping-NewStructure-Manuf-Semiconductors-ICs; Supplier 1: Newark; Supplier Part Number 1: 61AC2368; RoHS: Yes; Category: Interface ICs; Pricing 1: 1=1.29000, 10=1.16000, 25=1.10000, 50=1.00000, 100=0.90400, 250=0.84500 (USD); Mount: Surface Mount; Case/Package: SOIC; Number of Pins: 8; Min Operating Temperature: -40°C; Max Operating Temperature: 125°C; Packaging: Tape and Reel; RoHS Compliant: Yes; ComponentLink3URL: http://www.farnell.com/datasheets/2080616.pdf?src-supplier=Farnell; ComponentLink3Description: http://www.farnell.com/datasheets/2080616.pdf?src-supplier=Farnell; ComponentLink4URL: http://www.nxp.com/documents/data_sheet/TJF1051.pdf?src-supplier=Avnet; ComponentLink4Description: http://www.nxp.com/documents/data_sheet/TJF1051.pdf?src-supplier=Avnet

## Nets that join several sheets
GND: POWER (14 pins), CONNECTORS (19 pins), PROCESSOR (23 pins), COMMUNICATIONS (14 pins)
VCC_3.3V: POWER (C5.1 U2.3 VCC_3.3V.1), CONNECTORS (6 pins), PROCESSOR (14 pins), COMMUNICATIONS (5 pins)
VCC_5V: POWER (C3.1 R6.2 U1.3 VCC_5V.1), CONNECTORS (C9.1 J2.5), PROCESSOR (C20.2 U5.20), COMMUNICATIONS (7 pins)
AIRS_Signal_NMOS: CONNECTORS (AIR_Signal_NMOS.1 Q1.2 R16.2), PROCESSOR (U4.42)
CANH: CONNECTORS (J2.3), COMMUNICATIONS (CANH.1 R37.2 U7.7)
CANL: CONNECTORS (J2.4), COMMUNICATIONS (CANL.1 R37.1 U7.6)
CanRx: PROCESSOR (U4.44 U5.4), COMMUNICATIONS (U7.4)
CanRx_FromBuff: POWER (R3.2), PROCESSOR (U5.16)
CanTx: PROCESSOR (U4.45 U5.5), COMMUNICATIONS (U7.1)
CanTx_FromBuff: POWER (R4.2), PROCESSOR (U5.15)
CHANNEL1: CONNECTORS (C6.1 CHANNEL1.1 R10.1 R11.2), PROCESSOR (U4.14)
CHANNEL2: CONNECTORS (C11.2 CHANNEL2.1 R13.1 R15.2), PROCESSOR (U4.15)
ChargeSignal: CONNECTORS (R35.1), PROCESSOR (U4.41)
Charging: CONNECTORS (Charging_Signal_NMOS.1 Q2.2 R34.2), PROCESSOR (U4.22)
HEARTBEAT: POWER (R1.2), PROCESSOR (U5.18)
IM_Out_Connector: CONNECTORS (J4.2), COMMUNICATIONS (PulseTransformer1.3)
IP_Out_Connector: CONNECTORS (J4.1), COMMUNICATIONS (PulseTransformer1.4)
MISO: PROCESSOR (TP_MISO.1 U4.35), COMMUNICATIONS (R27.1 U6.3)
NetF1_1: POWER (F1.1), CONNECTORS (J3.1 J3.2)
NetTP_CS_1: PROCESSOR (TP_CS.1 U4.33), COMMUNICATIONS (U6.5)
NetTP_MOSI_1: PROCESSOR (TP_MOSI.1 U4.36), COMMUNICATIONS (U6.2)
NetTP_SCK_1: PROCESSOR (TP_SCK.1 U4.34), COMMUNICATIONS (U6.4)
RESET: CONNECTORS (J1.10 U3.2), PROCESSOR (U4.7 U5.6)
RESET_FromBuff: POWER (R5.2), PROCESSOR (U5.14)
SHUTDOWN: POWER (R2.2), CONNECTORS (J2.2), PROCESSOR (U5.17)
SWCLK: CONNECTORS (J1.4 R14.2), PROCESSOR (U4.49)
SWDIO: CONNECTORS (J1.2 R8.1), PROCESSOR (U4.46)